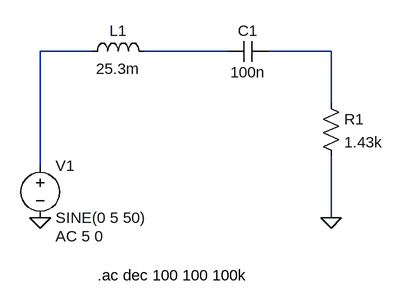
[diagram p0: schematic Band pass filter.asc]
Band pass filter.asc, the LTspice schematic file:
Version 4.1
SHEET 1 880 680
WIRE 80 32 0 32
WIRE 288 32 160 32
WIRE 448 32 352 32
WIRE 448 112 448 32
WIRE 0 208 0 32
WIRE 448 288 448 192
FLAG 0 288 0
FLAG 448 288 0
SYMBOL voltage 0 192 R0
WINDOW 123 24 124 Left 2
WINDOW 39 0 0 Left 0
SYMATTR InstName V1
SYMATTR Value SINE(0 5 50)
SYMATTR Value2 AC 5 0
SYMBOL ind 64 48 R270
WINDOW 0 32 56 VTop 2
WINDOW 3 5 56 VBottom 2
SYMATTR InstName L1
SYMATTR Value 25.3m
SYMATTR SpiceLine Rser=1m
SYMBOL cap 352 16 R90
WINDOW 0 0 32 VBottom 2
WINDOW 3 32 32 VTop 2
SYMATTR InstName C1
SYMATTR Value 100n
SYMBOL res 432 96 R0
SYMATTR InstName R1
SYMATTR Value 1.43k
TEXT 88 376 Left 2 !.ac dec 100 100 100k

The netlist it stands for:
* Band pass filter.asc
V1 N001 0 SINE(0 5 50) AC 5 0
L1 N001 N002 25.3m Rser=1m
C1 N003 N002 100n
R1 N003 0 1.43k
.ac dec 100 100 100k
.backanno
.end